# EasyEDA Pro project 课设.eprj

# Schematic Schematic1
Create Date: 2024-01-07; Page Name: P1; Project Name: 课设; Schematic Name: Schematic1; Update Date: 2024-01-07; Company: 嘉立创EDA; Page Size: A4; Version: V1.0
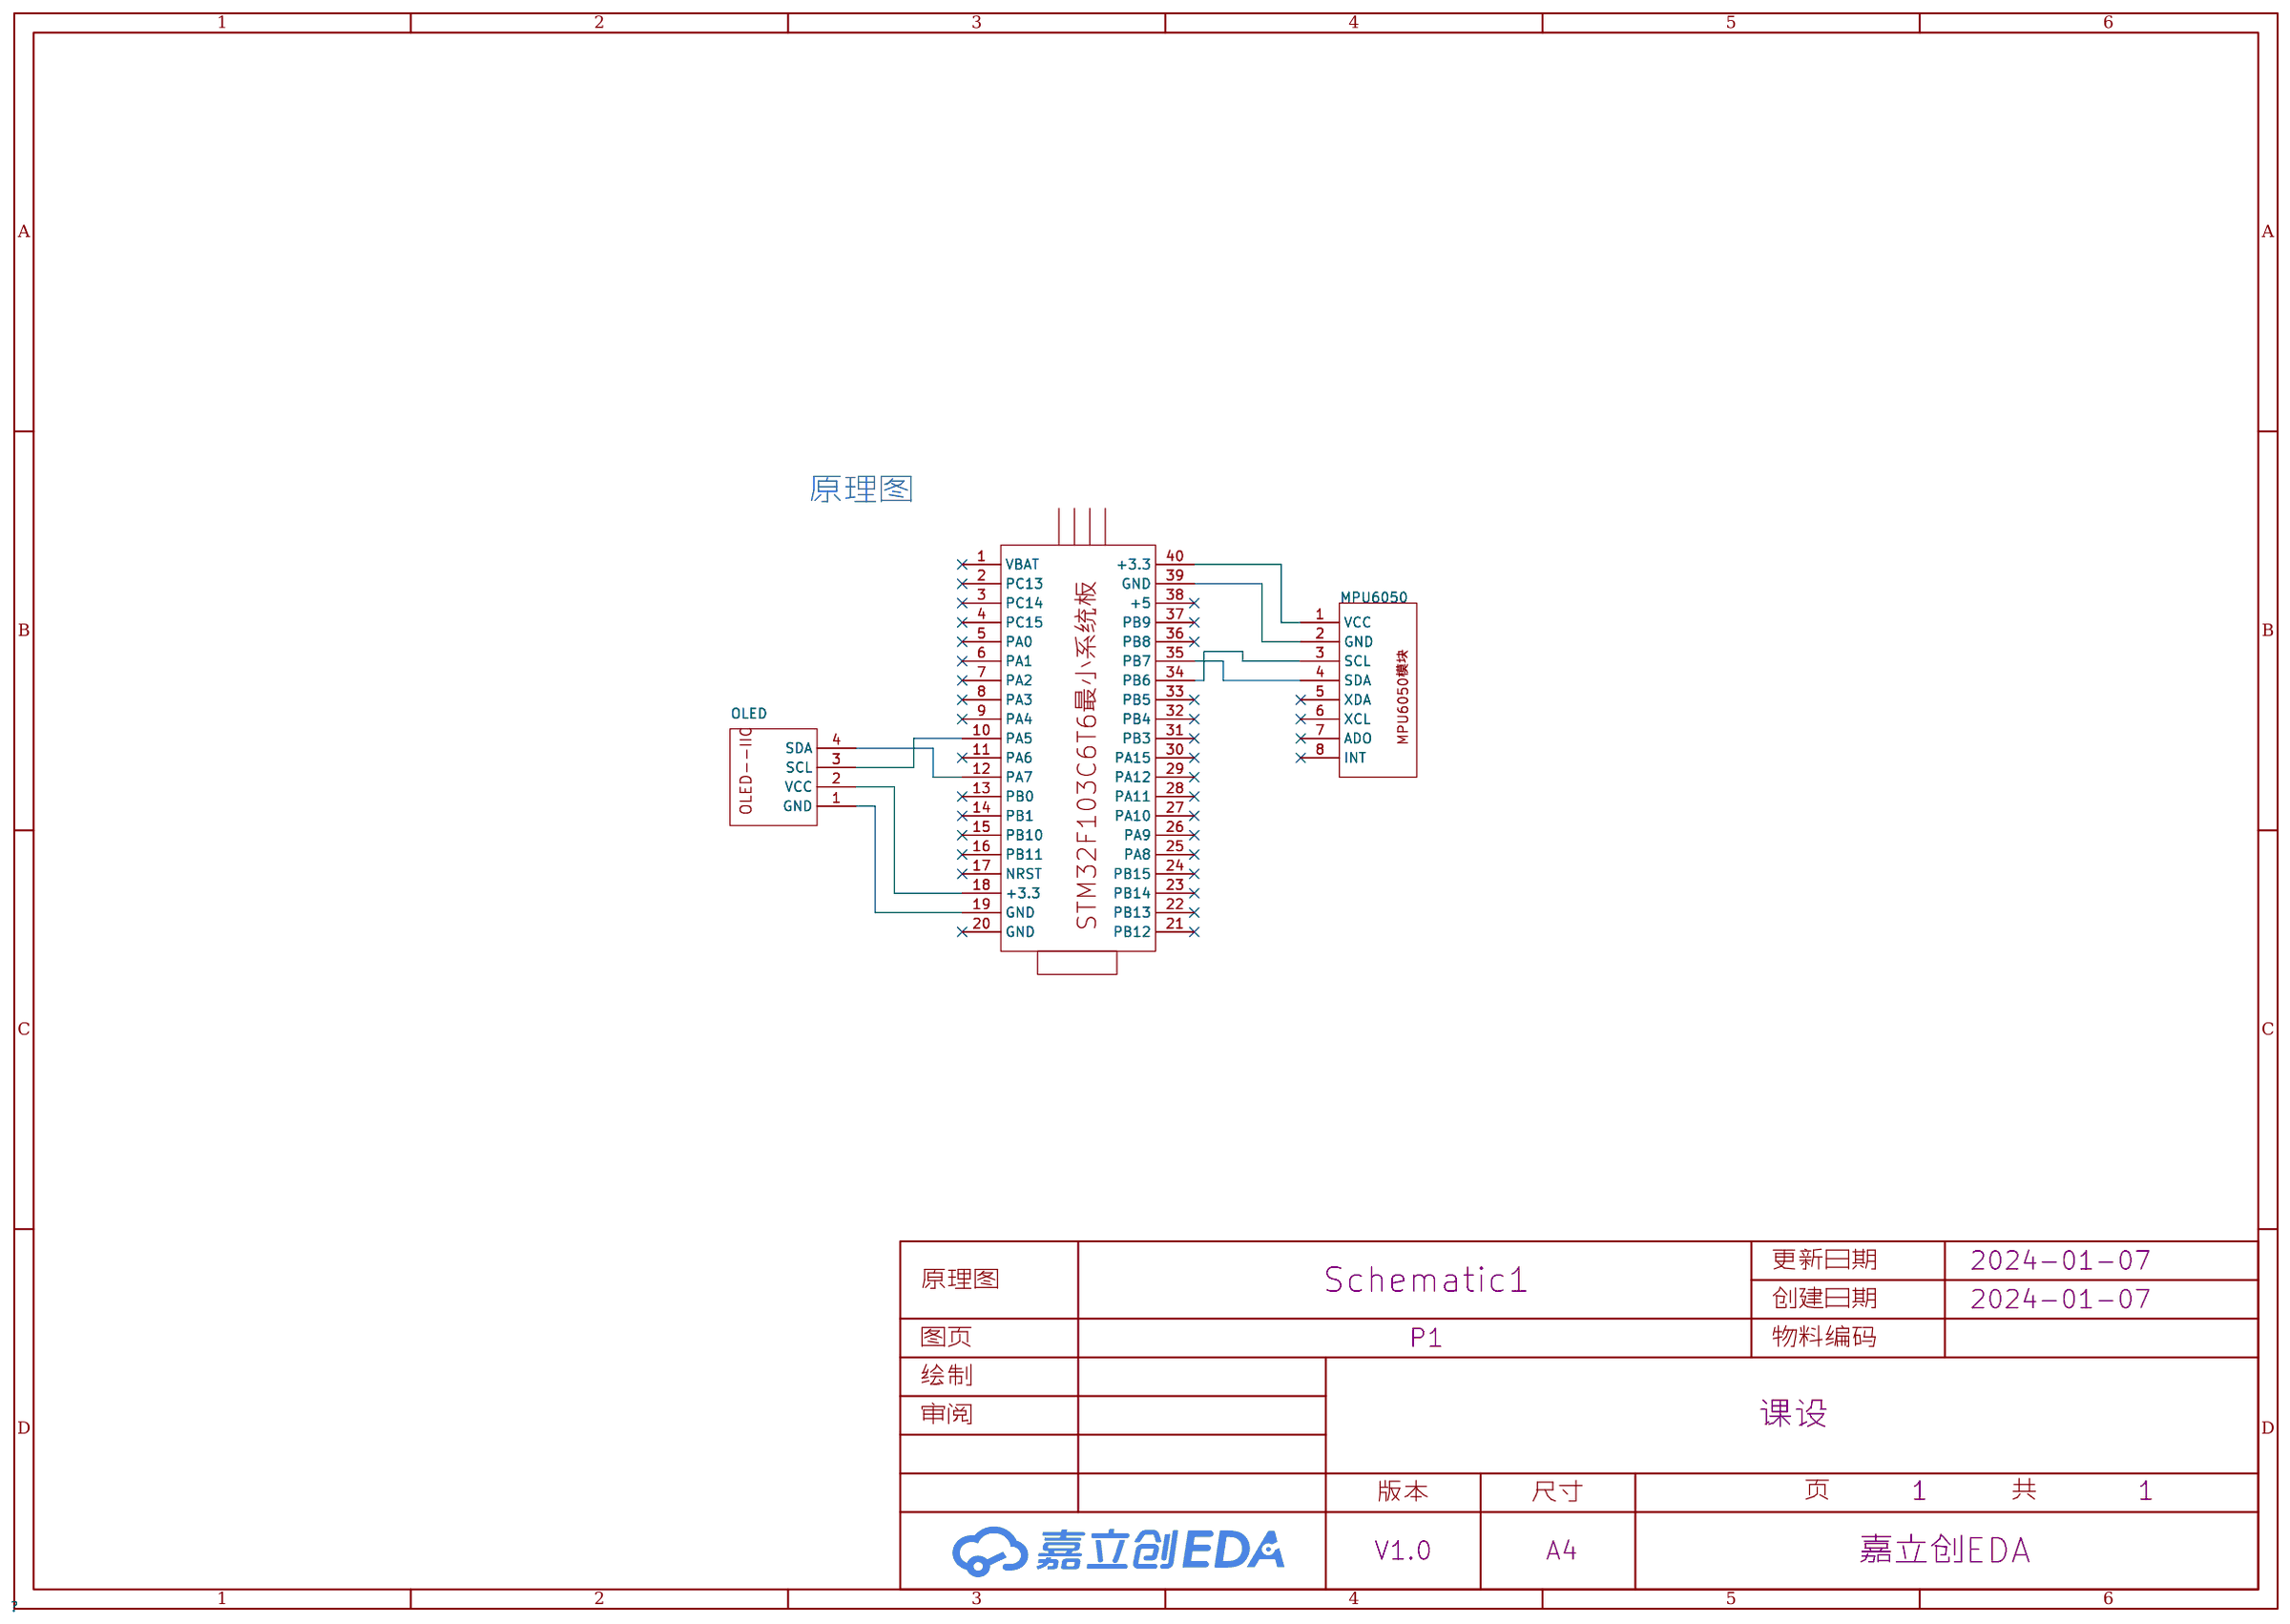
[diagram p0: schematic sheet]

## Parts
MPU6050  -  [mpu6050模块]
OLED  0.96OLED_4P  [0.96OLED_4P]
U1  -  [STM32F103C8T6最小系统板]

## Library data of the parts
MPU6050 = MPU6050模块
OLED = 0.96OLED_4P_MODULE_JX: Supplier Part: C9900004566; Supplier Footprint: 插件; JLCPCB Part Class: 扩展库; Datasheet: https://atta.szlcsc.comnull; Supplier: LCSC
U1 = STM32F103C6T6

## Nets
$1N331: OLED.4(SDA) U1.12(PA7)
$1N333: OLED.3(SCL) U1.10(PA5)
$1N504: MPU6050.4(SDA) U1.35(PB7)
$1N509: MPU6050.3(SCL) U1.34(PB6)
Net-(MPU6050-1): MPU6050.1(VCC) U1.40(+3.3)
Net-(MPU6050-2): MPU6050.2(GND) U1.39(GND)
Net-(OLED-1): OLED.1(GND) U1.19(GND)
Net-(OLED-2): OLED.2(VCC) U1.18(+3.3)

Not connected (* = marked no-connect by the designer): MPU6050 5(XDA)* 6(XCL)* 7(ADO)* 8(INT)*; U1 1(VBAT)* 2(PC13)* 3(PC14)* 4(PC15)* 5(PA0)* 6(PA1)* 7(PA2)* 8(PA3)* 9(PA4)* 11(PA6)* 13(PB0)* 14(PB1)* 15(PB10)* 16(PB11)* 17(NRST)* 20(GND)* 21(PB12)* 22(PB13)* 23(PB14)* 24(PB15)* 25(PA8)* 26(PA9)* 27(PA10)* 28(PA11)* 29(PA12)* 30(PA15)* 31(PB3)* 32(PB4)* 33(PB5)* 36(PB8)* 37(PB9)* 38(+5)*

## Notes on the sheet
- 原理图

# Board PCB1
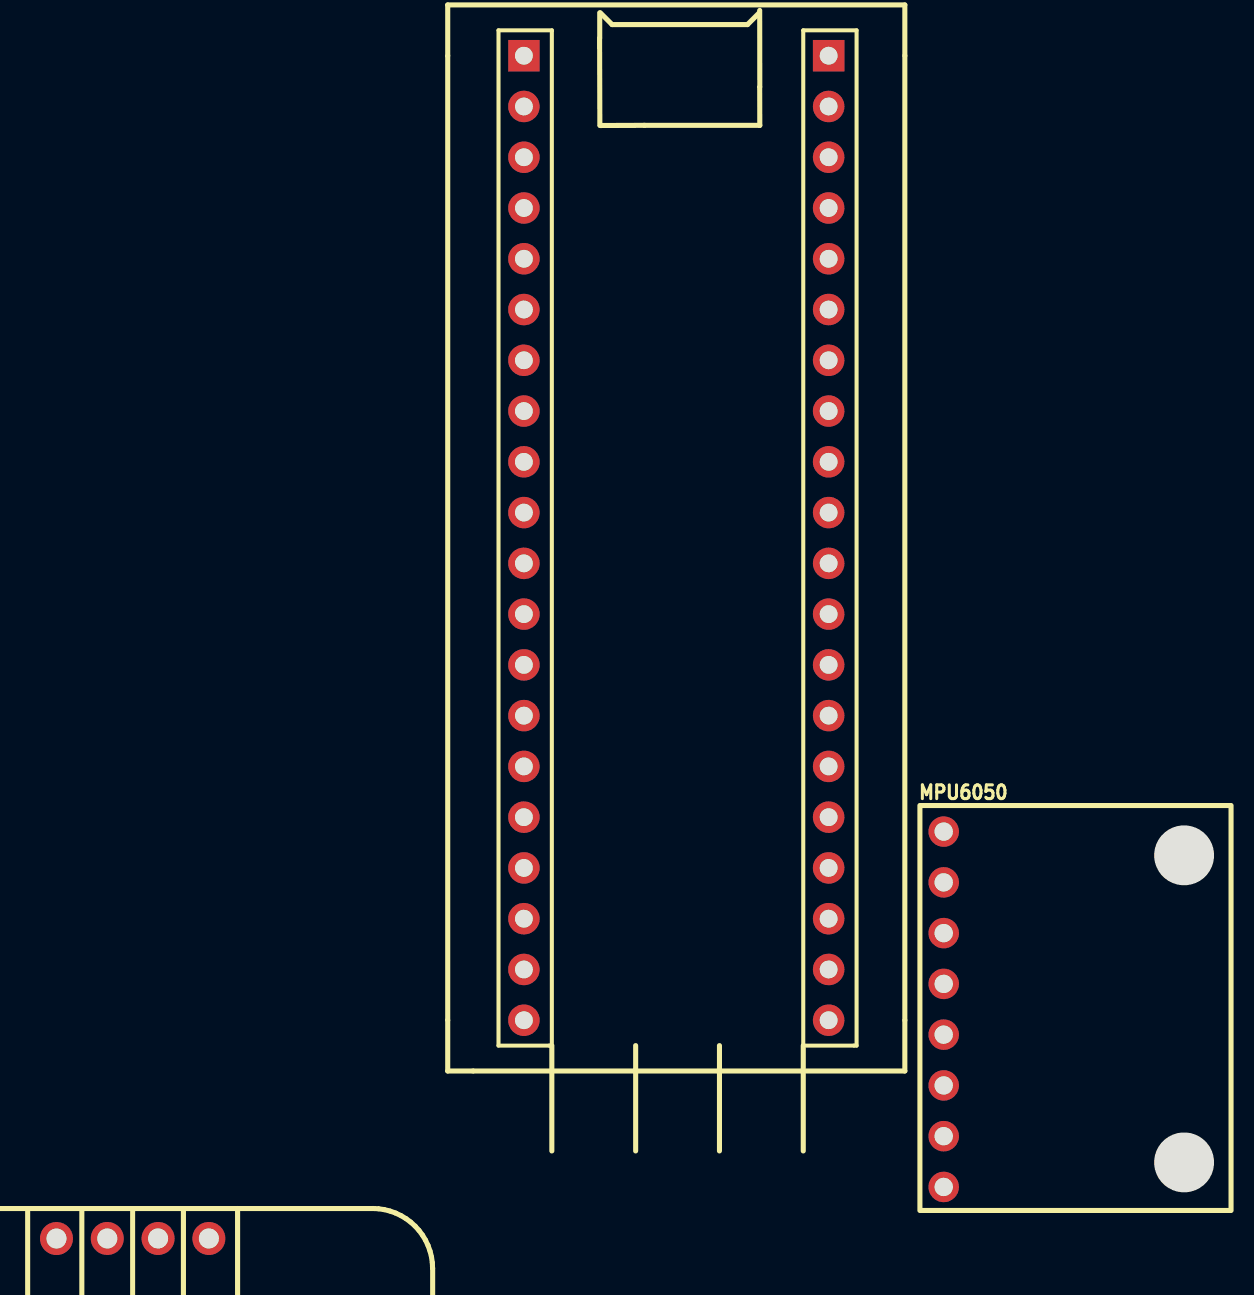
[diagram p1: board, top side]
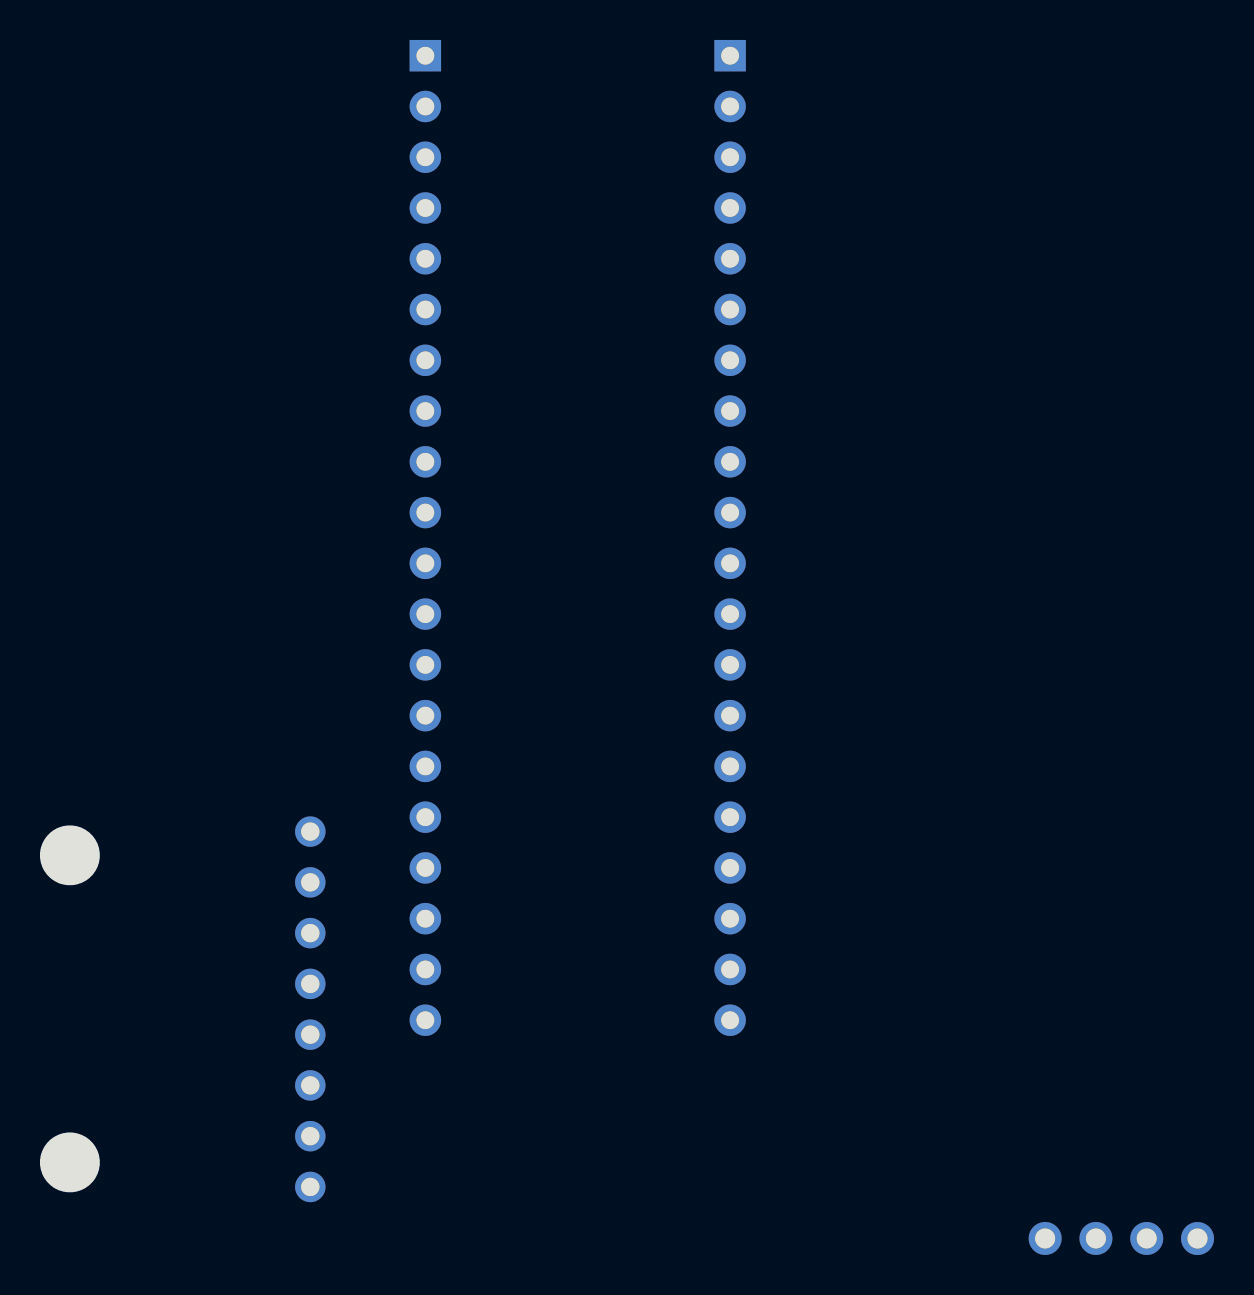
[diagram p2: board, bottom side, seen from below]

Outline 2.99 x 18.36 mm; copper layers: Top Layer, Bottom Layer. Coordinates in mm from the lower left corner of the outline.
Stack: Top Layer 0.035mm / Dielectric1 1.51mm FR4 er 4.5 / Bottom Layer 0.035mm

## Design rules (mm)
template: JLCPCB Capability(Two Layers Board)
spacing copperThickness1oz (default): track to track 0.102, other pairs 0.152 to 0.3
spacing copperThickness2oz: track to track 0.203, other pairs 0.152 to 0.3
track width copperThickness1oz (default): min 0.127, default 0.254, max 2.54
track width copperThickness2oz: min 0.203, default 0.254, max 2.54
differential pair differentialPair (default): width min 0.127, default 0.254, max 2.54; gap min 0.152, default 0.152
via viaSize (default): diameter min 0.5, default 0.61, max 10; hole min 0.3, default 0.305, max 6.3

## Placement (name value [footprint] x y rotation side)
MPU6050  -  [mpu6050模块]  -3.92 9.12 0 top
OLED  -  [0.96OLED_4P]  -51.09 -2.31 0 top
U1  -  [STM32F103C8T6最小系统板]  -23.9 26.39 0 top

## Footprints (pads in the part's own frame, mm; a bottom-side part is the same pattern mirrored in y, then rotated)
0.96OLED_4P
  round 1.65 hole 1: 1(-3.81,-0.002) 2(-1.27,0.002) 3(1.27,0.002) 4(3.81,0.002)
mpu6050模块
  round 1.524 hole 0.914: 1(-6.611,8.93) 2(-6.611,6.39) 3(-6.611,3.85) 4(-6.611,1.31) 5(-6.611,-1.23) 6(-6.611,-3.77) 7(-6.611,-6.31) 8(-6.611,-8.85)
STM32F103C8T6最小系统板
  round 1.575 hole 0.889: 1(7.62,-17.78) 2(7.62,-15.24) 3(7.62,-12.7) 4(7.62,-10.16) 5(7.62,-7.62) 6(7.62,-5.08) 7(7.62,-2.54) 8(7.62,0) 9(7.62,2.54) 10(7.62,5.08) 11(7.62,7.62) 12(7.62,10.16) 13(7.62,12.7) 14(7.62,15.24) 15(7.62,17.78) 16(7.62,20.32) 17(7.62,22.86) 18(7.62,25.4) 19(7.62,27.94) 22(-7.62,27.94) 23(-7.62,25.4) 24(-7.62,22.86) 25(-7.62,20.32) 26(-7.62,17.78) 27(-7.62,15.24) 28(-7.62,12.7) 29(-7.62,10.16) 30(-7.62,7.62) 31(-7.62,5.08) 32(-7.62,2.54) 33(-7.62,0) 34(-7.62,-2.54) 35(-7.62,-5.08) 36(-7.62,-7.62) 37(-7.62,-10.16) 38(-7.62,-12.7) 39(-7.62,-15.24) 40(-7.62,-17.78)
  rect 1.575x1.575 hole 0.889: 20(7.62,30.48) 21(-7.62,30.48)

## Nets
GND: MPU6050.2 OLED.1
VCC: MPU6050.1 OLED.2
$1N331: OLED.4 U1.12
$1N333: OLED.3 U1.10
$1N504: MPU6050.4 U1.35
$1N509: MPU6050.3 U1.34

Pads without a net: MPU6050 5 6 7 8; U1 1 2 3 4 5 6 7 8 9 11 13 14 15 16 17 18 19 20 21 22 23 24 25 26 27 28 29 30 31 32 33 36 37 38 39 40
